# EAGLE schematic schematic-incomplete (EAGLE 9.6.1)
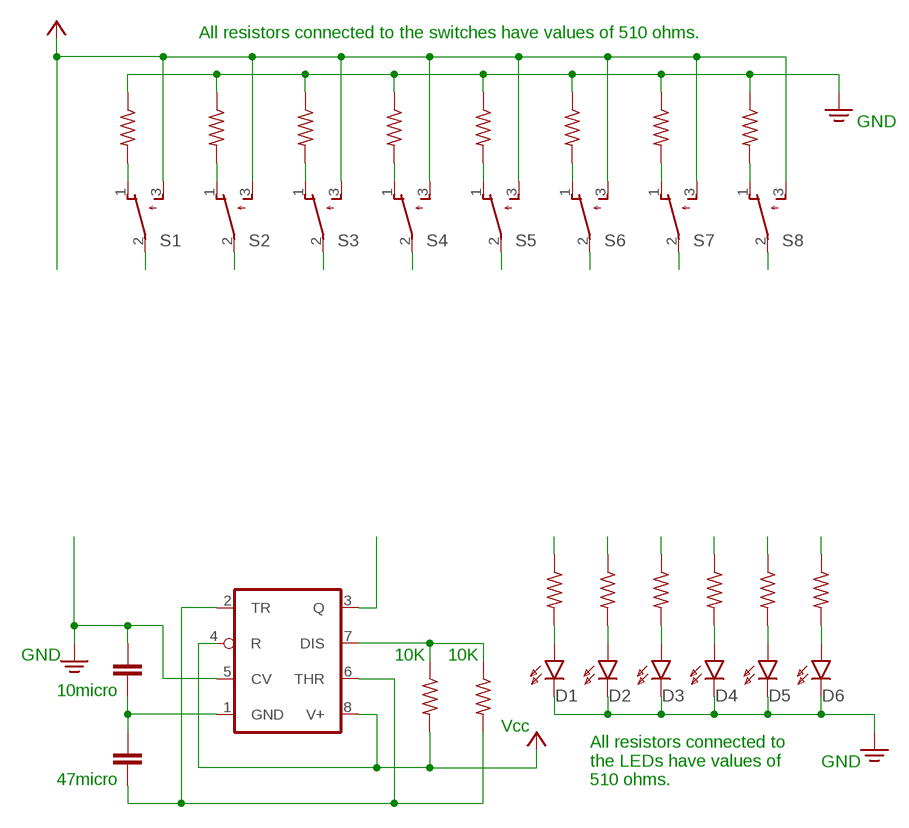
[diagram p0: schematic, sheet 1]

## Parts
10K  R-US_0204/7  [0204/7]
CX1  CXXC15B8  [XC15B8]
CX2  CXXC15B8  [XC15B8]
D1  HLMP6  [HLMP6]
D2  HLMP6  [HLMP6]
D3  HLMP6  [HLMP6]
D4  HLMP6  [HLMP6]
D5  HLMP6  [HLMP6]
D6  HLMP6  [HLMP6]
IC1  LM555N  [DIL08]
R1  R-US_0204/7  [0204/7]
R2  R-US_0204/7  [0204/7]
R3  R-US_0204/7  [0204/7]
R4  R-US_0204/7  [0204/7]
R5  R-US_0204/7  [0204/7]
R6  R-US_0204/7  [0204/7]
R7  R-US_0204/7  [0204/7]
R8  R-US_0204/7  [0204/7]
R9  R-US_0204/7  [0204/7]
R10  R-US_0204/7  [0204/7]
R11  R-US_0204/7  [0204/7]
R12  R-US_0204/7  [0204/7]
R13  R-US_0204/7  [0204/7]
R14  R-US_0204/7  [0204/7]
R15  R-US_0204/7  [0204/7]
S1  TL32PO  [TL3XPO]
S2  TL32PO  [TL3XPO]
S3  TL32PO  [TL3XPO]
S4  TL32PO  [TL3XPO]
S5  TL32PO  [TL3XPO]
S6  TL32PO  [TL3XPO]
S7  TL32PO  [TL3XPO]
S8  TL32PO  [TL3XPO]

## Nets
N$1: 10K.1 IC1.7(DIS) R2.1
N$2: R8.2 S7.1(O)
N$3: CX1.2 CX2.1 IC1.1(GND)
N$4: CX1.1 IC1.2(TR) IC1.6(THR) R2.2
N$5: R1.2 S1.1(O)
N$6: R3.2 S2.1(O)
N$7: R4.2 S3.1(O)
N$8: R5.2 S4.1(O)
N$9: R6.2 S5.1(O)
N$10: R7.2 S6.1(O)
N$11: R9.2 S8.1(O)
N$12: D1.A R10.2
N$13: D2.A R11.2
N$14: D3.A R12.2
N$15: D4.A R13.2
N$16: D5.A R14.2
N$17: D6.A R15.2
N$18: S1.2(P)
N$19: S2.2(P)
N$20: S3.2(P)
N$21: S4.2(P)
N$22: S5.2(P)
N$23: S6.2(P)
N$24: S7.2(P)
N$25: S8.2(P)
N$26: IC1.3(Q)
N$27: R10.1
N$28: R11.1
N$29: R12.1
N$30: R13.1
N$31: R14.1
N$32: R15.1
PE: CX2.2 D1.K D2.K D3.K D4.K D5.K D6.K IC1.5(CV) R1.1 R3.1 R4.1 R5.1 R6.1 R7.1 R8.1 R9.1
V+: 10K.2 IC1.4(R) IC1.8(V+) S1.3(S) S2.3(S) S3.3(S) S4.3(S) S5.3(S) S6.3(S) S7.3(S) S8.3(S)

## Notes on the sheet
- All resistors connected to the switches have values of 510 ohms.
- GND
- GND | 10K | 10K
- 10micro
- Vcc
- GND
- 47micro
- All resistors connected to
  the LEDs have values of 
  510 ohms.

## Library data of the parts
10K R1-R15 = rcl:R-US_: RESISTOR, American symbol; SPICEPREFIX: R
CX1 CX2 = rcl:CX: X CAPACITOR for power line; SPICEPREFIX: C
D1-D6 = display-hp:HLMP6: LED 2mm horizontal; MF: AGILENT TECHNOLOGIES; MPN: HLMP-6500; OC_FARNELL: 1652490; OC_NEWARK: 40K0088
IC1 = linear:*555: TIMER
S1-S8 = switch:TL32PO: TINY SWITCH ON - MOM Source: http://www2.produktinfo.conrad.com/datenblaetter/700000-724999/705152-da-01-de-Subminiaturschalter_TL_36YO.pdf